# Altium schematic sheet FMC_connector.SchDoc
size A2; DocumentNumber: 3; SheetNumber: 3; SheetTotal: 30
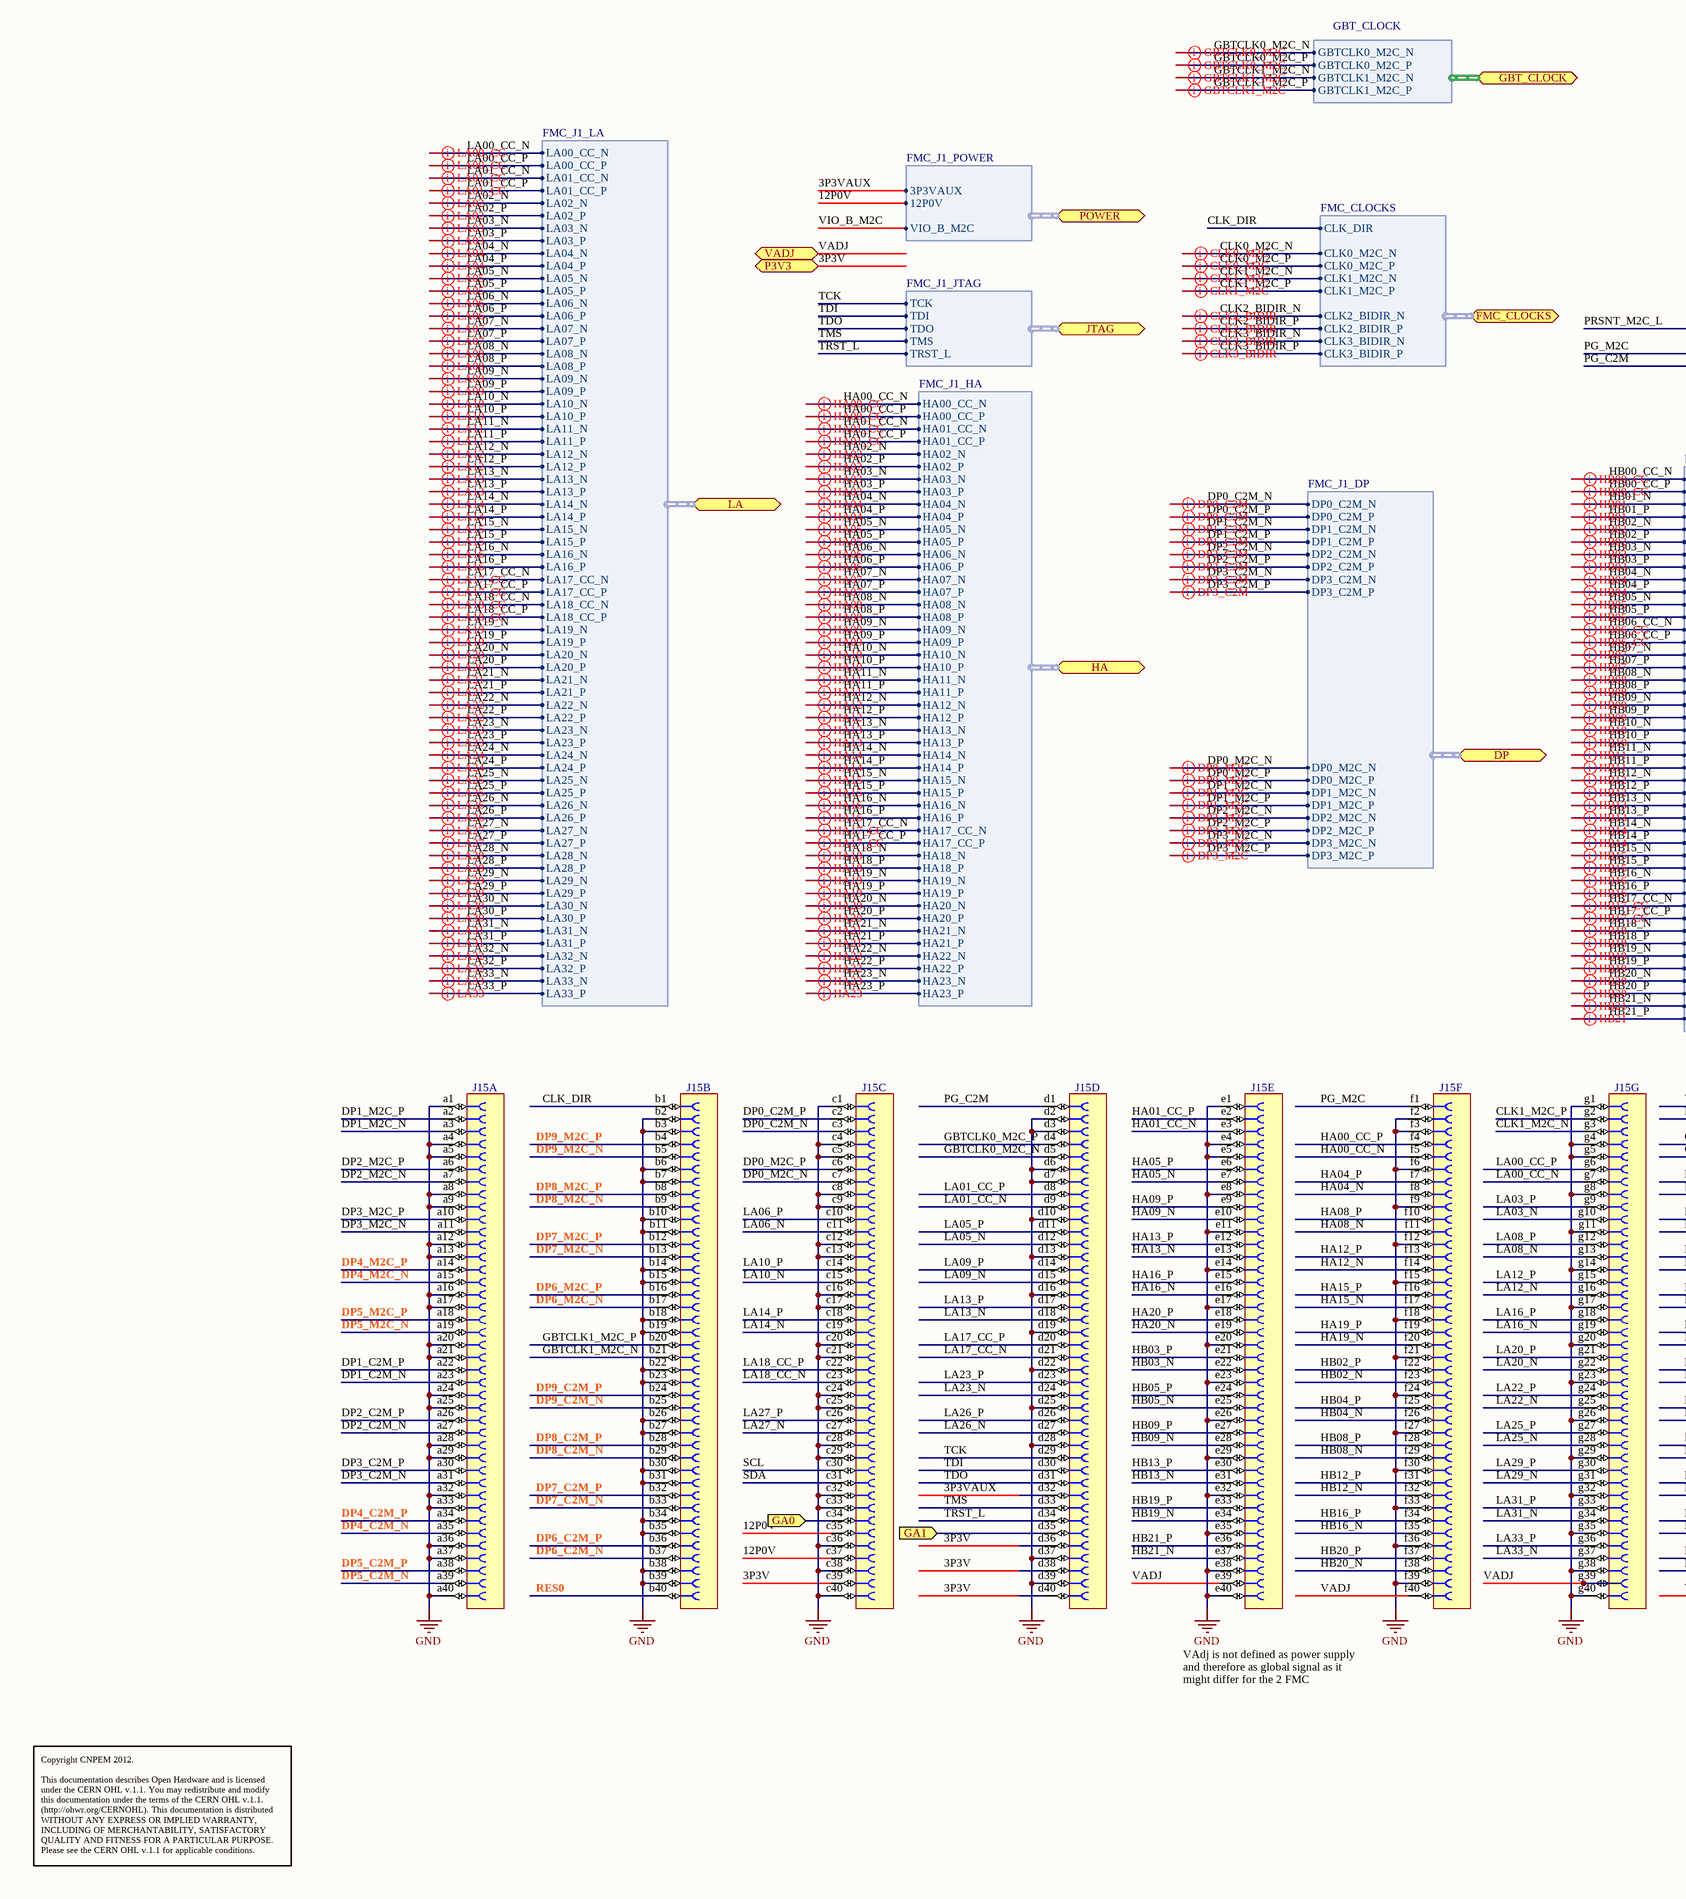
[diagram p0: FMC_connector.SchDoc, left]
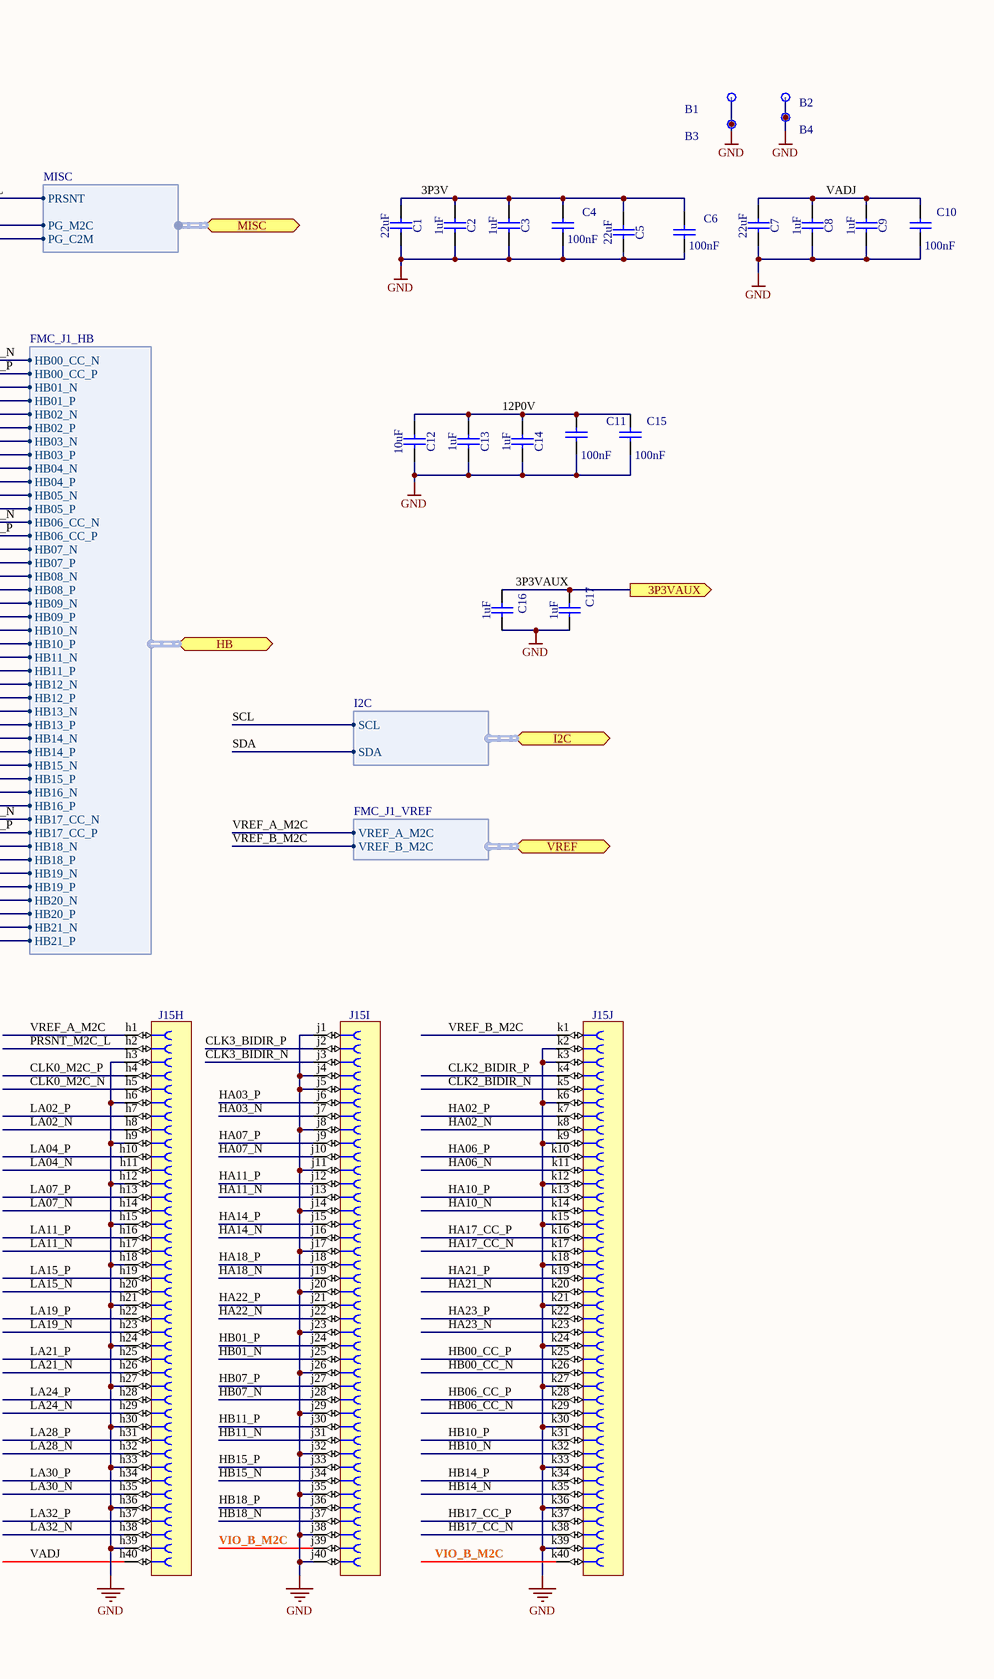
[diagram p1: FMC_connector.SchDoc, right]

## Parts
B1  Plated Hole  [MTG270_500]  (value not drawn)
B2  Plated Hole  [MTG270_500]  (value not drawn)
B3  Plated Hole  [MTG270_500]  (value not drawn)
B4  Plated Hole  [MTG270_500]  (value not drawn)
C1  22uF  [CAPC3216X180N]
C2  1uF  [CAPC1608X87N]
C3  1uF  [CAPC1608X87N]
C4  100nF  [CAPC0603X33N]
C5  22uF  [CAPC3216X180N]
C6  100nF  [CAPC0603X33N]
C7  22uF  [CAPC3216X180N]
C8  1uF  [CAPC1608X87N]
C9  1uF  [CAPC1608X87N]
C10  100nF  [CAPC0603X33N]
C11  100nF  [CAPC0603X33N]
C12  10uF  [CAPC2012X135N]
C13  1uF  [CAPC1608X87N]
C14  1uF  [CAPC1608X87N]
C15  100nF  [CAPC0603X33N]
C16  1uF  [CAPC1608X87N]
C17  1uF  [CAPC1608X87N]
J15  VITA 57  [SAMTEC_ASP-134486-01]  (value not drawn)  (parts A,B,C,D,E,F,G,H,I,J of 10)

## Ports
3P3VAUX (out), DP (harness FMC_J1_DP), FMC_CLOCKS (harness FMC_CLOCKS), GA0 (in), GA1 (in), GBT_CLOCK (harness GBT_CLOCK), HA (harness FMC_J1_HA), HB (harness FMC_J1_HB), I2C (harness I2C), JTAG (harness FMC_J1_JTAG), LA (harness FMC_J1_LA), MISC (harness MISC), P3V3, POWER (harness FMC_J1_POWER), VADJ, VREF (harness FMC_J1_VREF)

## Harnesses
FMC_J1_DP: DP1_C2M_N, DP1_C2M_P, DP1_M2C_N, DP1_M2C_P, DP2_C2M_N, DP2_C2M_P, DP2_M2C_N, DP2_M2C_P, DP3_C2M_N, DP3_C2M_P, DP3_M2C_N, DP3_M2C_P, DP0_C2M_N, DP0_C2M_P, DP0_M2C_N, DP0_M2C_P
FMC_J1_LA: LA05_N, LA05_P, LA06_N, LA06_P, LA09_N, LA09_P, LA10_N, LA10_P, LA13_N, LA13_P, LA14_N, LA14_P, LA23_N, LA23_P, LA26_N, LA26_P, LA27_N, LA27_P, LA02_N, LA02_P, LA03_N, LA03_P, LA04_N, LA04_P, LA07_N, LA07_P, LA08_N, LA08_P, LA11_N, LA11_P, LA12_N, LA12_P, LA15_N, LA15_P, LA16_N, LA16_P, LA19_N, LA19_P, LA20_N, LA20_P, LA21_N, LA21_P, LA22_N, LA22_P, LA24_N, LA24_P, LA25_N, LA25_P, LA28_N, LA28_P, LA29_N, LA29_P, LA30_N, LA30_P, LA31_N, LA31_P, LA32_N, LA32_P, LA33_N, LA33_P, LA00_CC_N, LA00_CC_P, LA01_CC_N, LA01_CC_P, LA17_CC_N, LA17_CC_P, LA18_CC_N, LA18_CC_P
FMC_J1_HA: HA04_N, HA04_P, HA05_N, HA05_P, HA08_N, HA08_P, HA09_N, HA09_P, HA12_N, HA12_P, HA13_N, HA13_P, HA15_N, HA15_P, HA16_N, HA16_P, HA19_N, HA19_P, HA20_N, HA20_P, HA02_N, HA02_P, HA03_N, HA03_P, HA06_N, HA06_P, HA07_N, HA07_P, HA10_N, HA10_P, HA11_N, HA11_P, HA14_N, HA14_P, HA18_N, HA18_P, HA21_N, HA21_P, HA22_N, HA22_P, HA23_N, HA23_P, HA17_CC_N, HA17_CC_P, HA00_CC_N, HA00_CC_P, HA01_CC_N, HA01_CC_P
FMC_J1_HB: HB02_N, HB02_P, HB03_N, HB03_P, HB04_N, HB04_P, HB05_N, HB05_P, HB08_N, HB08_P, HB09_N, HB09_P, HB12_N, HB12_P, HB13_N, HB13_P, HB16_N, HB16_P, HB19_N, HB19_P, HB20_N, HB20_P, HB21_N, HB21_P, HB01_N, HB01_P, HB07_N, HB07_P, HB10_N, HB10_P, HB11_N, HB11_P, HB14_N, HB14_P, HB15_N, HB15_P, HB18_N, HB18_P, HB17_CC_N, HB17_CC_P, HB06_CC_N, HB06_CC_P, HB00_CC_N, HB00_CC_P
FMC_J1_POWER: 3P3VAUX, 12P0V, VIO_B_M2C
FMC_J1_JTAG: TCK, TDI, TDO, TMS, TRST_L
I2C: SCL, SDA
FMC_CLOCKS: CLK2_BIDIR_N, CLK2_BIDIR_P, CLK3_BIDIR_N, CLK3_BIDIR_P, CLK0_M2C_N, CLK0_M2C_P, CLK1_M2C_N, CLK1_M2C_P, CLK_DIR
FMC_J1_VREF: VREF_A_M2C, VREF_B_M2C
GBT_CLOCK: GBTCLK0_M2C_N, GBTCLK0_M2C_P, GBTCLK1_M2C_N, GBTCLK1_M2C_P
MISC: PRSNT, PG_M2C, PG_C2M

## Nets
GND: B1.1 B2.1 B3.1 B4.1 C1.2 C2.2 C3.2 C4.1 C5.2 C6.1 C7.2 C8.2 C9.2 C10.1 C11.1 C12.2 C13.2 C14.2 C15.1 C16.2 C17.2 J15.a1 J15.a4 J15.a5 J15.a8 J15.a9 J15.a12 J15.a13 J15.a16 J15.a17 J15.a20 J15.a21 J15.a24 J15.a25 J15.a28 J15.a29 J15.a32 J15.a33 J15.a36 J15.a37 J15.a40 J15.b2 J15.b3 J15.b6 J15.b7 J15.b10 J15.b11 J15.b14 J15.b15 J15.b18 J15.b19 J15.b22 J15.b23 J15.b26 J15.b27 J15.b30 J15.b31 J15.b34 J15.b35 J15.b38 J15.b39 J15.c1 J15.c4 J15.c5 J15.c8 J15.c9 J15.c12 J15.c13 J15.c16 J15.c17 J15.c20 J15.c21 J15.c24 J15.c25 J15.c28 J15.c29 J15.c32 J15.c33 J15.c36 J15.c38 J15.c40 J15.d2 J15.d3 J15.d6 J15.d7 J15.d10 J15.d13 J15.d16 J15.d19 J15.d22 J15.d25 J15.d28 J15.d37 J15.d39 J15.e1 J15.e4 J15.e5 J15.e8 J15.e11 J15.e14 J15.e17 J15.e20 J15.e23 J15.e26 J15.e29 J15.e32 J15.e35 J15.e38 J15.e40 J15.f2 J15.f3 J15.f6 J15.f9 J15.f12 J15.f15 J15.f18 J15.f21 J15.f24 J15.f27 J15.f30 J15.f33 J15.f36 J15.f39 J15.g1 J15.g4 J15.g5 J15.g8 J15.g11 J15.g14 J15.g17 J15.g20 J15.g23 J15.g26 J15.g29 J15.g32 J15.g35 J15.g38 J15.g40 J15.h3 J15.h6 J15.h9 J15.h12 J15.h15 J15.h18 J15.h21 J15.h24 J15.h27 J15.h30 J15.h33 J15.h36 J15.h39 J15.j1 J15.j4 J15.j5 J15.j8 J15.j11 J15.j14 J15.j17 J15.j20 J15.j23 J15.j26 J15.j29 J15.j32 J15.j35 J15.j38 J15.j40 J15.k2 J15.k3 J15.k6 J15.k9 J15.k12 J15.k15 J15.k18 J15.k21 J15.k24 J15.k27 J15.k30 J15.k33 J15.k36 J15.k39
3P3V: C1.1 C2.1 C3.1 C4.2 C5.1 C6.2 J15.c39 J15.d36 J15.d38 J15.d40 ; port P3V3
3P3VAUX: C16.1 C17.1 J15.d32 ; port 3P3VAUX, port POWER.3P3VAUX
12P0V: C11.2 C12.1 C13.1 C14.1 C15.2 J15.c35 J15.c37 ; port POWER.12P0V
CLK0_M2C_N: J15.h5 ; port FMC_CLOCKS.CLK0_M2C_N
CLK0_M2C_P: J15.h4 ; port FMC_CLOCKS.CLK0_M2C_P
CLK1_M2C_N: J15.g3 ; port FMC_CLOCKS.CLK1_M2C_N
CLK1_M2C_P: J15.g2 ; port FMC_CLOCKS.CLK1_M2C_P
CLK2_BIDIR_N: J15.k5 ; port FMC_CLOCKS.CLK2_BIDIR_N
CLK2_BIDIR_P: J15.k4 ; port FMC_CLOCKS.CLK2_BIDIR_P
CLK3_BIDIR_N: J15.j3 ; port FMC_CLOCKS.CLK3_BIDIR_N
CLK3_BIDIR_P: J15.j2 ; port FMC_CLOCKS.CLK3_BIDIR_P
CLK_DIR: J15.b1 ; port FMC_CLOCKS.CLK_DIR
DP0_C2M_N: J15.c3 ; port DP.DP0_C2M_N
DP0_C2M_P: J15.c2 ; port DP.DP0_C2M_P
DP0_M2C_N: J15.c7 ; port DP.DP0_M2C_N
DP0_M2C_P: J15.c6 ; port DP.DP0_M2C_P
DP1_C2M_N: J15.a23 ; port DP.DP1_C2M_N
DP1_C2M_P: J15.a22 ; port DP.DP1_C2M_P
DP1_M2C_N: J15.a3 ; port DP.DP1_M2C_N
DP1_M2C_P: J15.a2 ; port DP.DP1_M2C_P
DP2_C2M_N: J15.a27 ; port DP.DP2_C2M_N
DP2_C2M_P: J15.a26 ; port DP.DP2_C2M_P
DP2_M2C_N: J15.a7 ; port DP.DP2_M2C_N
DP2_M2C_P: J15.a6 ; port DP.DP2_M2C_P
DP3_C2M_N: J15.a31 ; port DP.DP3_C2M_N
DP3_C2M_P: J15.a30 ; port DP.DP3_C2M_P
DP3_M2C_N: J15.a11 ; port DP.DP3_M2C_N
DP3_M2C_P: J15.a10 ; port DP.DP3_M2C_P
GA0: J15.c34 ; port GA0
GA1: J15.d35 ; port GA1
GBTCLK0_M2C_N: J15.d5 ; port GBT_CLOCK.GBTCLK0_M2C_N
GBTCLK0_M2C_P: J15.d4 ; port GBT_CLOCK.GBTCLK0_M2C_P
GBTCLK1_M2C_N: J15.b21 ; port GBT_CLOCK.GBTCLK1_M2C_N
GBTCLK1_M2C_P: J15.b20 ; port GBT_CLOCK.GBTCLK1_M2C_P
HA00_CC_N: J15.f5 ; port HA.HA00_CC_N
HA00_CC_P: J15.f4 ; port HA.HA00_CC_P
HA01_CC_N: J15.e3 ; port HA.HA01_CC_N
HA01_CC_P: J15.e2 ; port HA.HA01_CC_P
HA02_N: J15.k8 ; port HA.HA02_N
HA02_P: J15.k7 ; port HA.HA02_P
HA03_N: J15.j7 ; port HA.HA03_N
HA03_P: J15.j6 ; port HA.HA03_P
HA04_N: J15.f8 ; port HA.HA04_N
HA04_P: J15.f7 ; port HA.HA04_P
HA05_N: J15.e7 ; port HA.HA05_N
HA05_P: J15.e6 ; port HA.HA05_P
HA06_N: J15.k11 ; port HA.HA06_N
HA06_P: J15.k10 ; port HA.HA06_P
HA07_N: J15.j10 ; port HA.HA07_N
HA07_P: J15.j9 ; port HA.HA07_P
HA08_N: J15.f11 ; port HA.HA08_N
HA08_P: J15.f10 ; port HA.HA08_P
HA09_N: J15.e10 ; port HA.HA09_N
HA09_P: J15.e9 ; port HA.HA09_P
HA10_N: J15.k14 ; port HA.HA10_N
HA10_P: J15.k13 ; port HA.HA10_P
HA11_N: J15.j13 ; port HA.HA11_N
HA11_P: J15.j12 ; port HA.HA11_P
HA12_N: J15.f14 ; port HA.HA12_N
HA12_P: J15.f13 ; port HA.HA12_P
HA13_N: J15.e13 ; port HA.HA13_N
HA13_P: J15.e12 ; port HA.HA13_P
HA14_N: J15.j16 ; port HA.HA14_N
HA14_P: J15.j15 ; port HA.HA14_P
HA15_N: J15.f17 ; port HA.HA15_N
HA15_P: J15.f16 ; port HA.HA15_P
HA16_N: J15.e16 ; port HA.HA16_N
HA16_P: J15.e15 ; port HA.HA16_P
HA17_CC_N: J15.k17 ; port HA.HA17_CC_N
HA17_CC_P: J15.k16 ; port HA.HA17_CC_P
HA18_N: J15.j19 ; port HA.HA18_N
HA18_P: J15.j18 ; port HA.HA18_P
HA19_N: J15.f20 ; port HA.HA19_N
HA19_P: J15.f19 ; port HA.HA19_P
HA20_N: J15.e19 ; port HA.HA20_N
HA20_P: J15.e18 ; port HA.HA20_P
HA21_N: J15.k20 ; port HA.HA21_N
HA21_P: J15.k19 ; port HA.HA21_P
HA22_N: J15.j22 ; port HA.HA22_N
HA22_P: J15.j21 ; port HA.HA22_P
HA23_N: J15.k23 ; port HA.HA23_N
HA23_P: J15.k22 ; port HA.HA23_P
HB00_CC_N: J15.k26 ; port HB.HB00_CC_N
HB00_CC_P: J15.k25 ; port HB.HB00_CC_P
HB01_N: J15.j25 ; port HB.HB01_N
HB01_P: J15.j24 ; port HB.HB01_P
HB02_N: J15.f23 ; port HB.HB02_N
HB02_P: J15.f22 ; port HB.HB02_P
HB03_N: J15.e22 ; port HB.HB03_N
HB03_P: J15.e21 ; port HB.HB03_P
HB04_N: J15.f26 ; port HB.HB04_N
HB04_P: J15.f25 ; port HB.HB04_P
HB05_N: J15.e25 ; port HB.HB05_N
HB05_P: J15.e24 ; port HB.HB05_P
HB06_CC_N: J15.k29 ; port HB.HB06_CC_N
HB06_CC_P: J15.k28 ; port HB.HB06_CC_P
HB07_N: J15.j28 ; port HB.HB07_N
HB07_P: J15.j27 ; port HB.HB07_P
HB08_N: J15.f29 ; port HB.HB08_N
HB08_P: J15.f28 ; port HB.HB08_P
HB09_N: J15.e28 ; port HB.HB09_N
HB09_P: J15.e27 ; port HB.HB09_P
HB10_N: J15.k32 ; port HB.HB10_N
HB10_P: J15.k31 ; port HB.HB10_P
HB11_N: J15.j31 ; port HB.HB11_N
HB11_P: J15.j30 ; port HB.HB11_P
HB12_N: J15.f32 ; port HB.HB12_N
HB12_P: J15.f31 ; port HB.HB12_P
HB13_N: J15.e31 ; port HB.HB13_N
HB13_P: J15.e30 ; port HB.HB13_P
HB14_N: J15.k35 ; port HB.HB14_N
HB14_P: J15.k34 ; port HB.HB14_P
HB15_N: J15.j34 ; port HB.HB15_N
HB15_P: J15.j33 ; port HB.HB15_P
HB16_N: J15.f35 ; port HB.HB16_N
HB16_P: J15.f34 ; port HB.HB16_P
HB17_CC_N: J15.k38 ; port HB.HB17_CC_N
HB17_CC_P: J15.k37 ; port HB.HB17_CC_P
HB18_N: J15.j37 ; port HB.HB18_N
HB18_P: J15.j36 ; port HB.HB18_P
HB19_N: J15.e34 ; port HB.HB19_N
HB19_P: J15.e33 ; port HB.HB19_P
HB20_N: J15.f38 ; port HB.HB20_N
HB20_P: J15.f37 ; port HB.HB20_P
HB21_N: J15.e37 ; port HB.HB21_N
HB21_P: J15.e36 ; port HB.HB21_P
LA00_CC_N: J15.g7 ; port LA.LA00_CC_N
LA00_CC_P: J15.g6 ; port LA.LA00_CC_P
LA01_CC_N: J15.d9 ; port LA.LA01_CC_N
LA01_CC_P: J15.d8 ; port LA.LA01_CC_P
LA02_N: J15.h8 ; port LA.LA02_N
LA02_P: J15.h7 ; port LA.LA02_P
LA03_N: J15.g10 ; port LA.LA03_N
LA03_P: J15.g9 ; port LA.LA03_P
LA04_N: J15.h11 ; port LA.LA04_N
LA04_P: J15.h10 ; port LA.LA04_P
LA05_N: J15.d12 ; port LA.LA05_N
LA05_P: J15.d11 ; port LA.LA05_P
LA06_N: J15.c11 ; port LA.LA06_N
LA06_P: J15.c10 ; port LA.LA06_P
LA07_N: J15.h14 ; port LA.LA07_N
LA07_P: J15.h13 ; port LA.LA07_P
LA08_N: J15.g13 ; port LA.LA08_N
LA08_P: J15.g12 ; port LA.LA08_P
LA09_N: J15.d15 ; port LA.LA09_N
LA09_P: J15.d14 ; port LA.LA09_P
LA10_N: J15.c15 ; port LA.LA10_N
LA10_P: J15.c14 ; port LA.LA10_P
LA11_N: J15.h17 ; port LA.LA11_N
LA11_P: J15.h16 ; port LA.LA11_P
LA12_N: J15.g16 ; port LA.LA12_N
LA12_P: J15.g15 ; port LA.LA12_P
LA13_N: J15.d18 ; port LA.LA13_N
LA13_P: J15.d17 ; port LA.LA13_P
LA14_N: J15.c19 ; port LA.LA14_N
LA14_P: J15.c18 ; port LA.LA14_P
LA15_N: J15.h20 ; port LA.LA15_N
LA15_P: J15.h19 ; port LA.LA15_P
LA16_N: J15.g19 ; port LA.LA16_N
LA16_P: J15.g18 ; port LA.LA16_P
LA17_CC_N: J15.d21 ; port LA.LA17_CC_N
LA17_CC_P: J15.d20 ; port LA.LA17_CC_P
LA18_CC_N: J15.c23 ; port LA.LA18_CC_N
LA18_CC_P: J15.c22 ; port LA.LA18_CC_P
LA19_N: J15.h23 ; port LA.LA19_N
LA19_P: J15.h22 ; port LA.LA19_P
LA20_N: J15.g22 ; port LA.LA20_N
LA20_P: J15.g21 ; port LA.LA20_P
LA21_N: J15.h26 ; port LA.LA21_N
LA21_P: J15.h25 ; port LA.LA21_P
LA22_N: J15.g25 ; port LA.LA22_N
LA22_P: J15.g24 ; port LA.LA22_P
LA23_N: J15.d24 ; port LA.LA23_N
LA23_P: J15.d23 ; port LA.LA23_P
LA24_N: J15.h29 ; port LA.LA24_N
LA24_P: J15.h28 ; port LA.LA24_P
LA25_N: J15.g28 ; port LA.LA25_N
LA25_P: J15.g27 ; port LA.LA25_P
LA26_N: J15.d27 ; port LA.LA26_N
LA26_P: J15.d26 ; port LA.LA26_P
LA27_N: J15.c27 ; port LA.LA27_N
LA27_P: J15.c26 ; port LA.LA27_P
LA28_N: J15.h32 ; port LA.LA28_N
LA28_P: J15.h31 ; port LA.LA28_P
LA29_N: J15.g31 ; port LA.LA29_N
LA29_P: J15.g30 ; port LA.LA29_P
LA30_N: J15.h35 ; port LA.LA30_N
LA30_P: J15.h34 ; port LA.LA30_P
LA31_N: J15.g34 ; port LA.LA31_N
LA31_P: J15.g33 ; port LA.LA31_P
LA32_N: J15.h38 ; port LA.LA32_N
LA32_P: J15.h37 ; port LA.LA32_P
LA33_N: J15.g37 ; port LA.LA33_N
LA33_P: J15.g36 ; port LA.LA33_P
PG_C2M: J15.d1 ; port MISC.PG_C2M
PG_M2C: J15.f1 ; port MISC.PG_M2C
PRSNT_M2C_L: J15.h2 ; port MISC.PRSNT
SCL: J15.c30 ; port I2C.SCL
SDA: J15.c31 ; port I2C.SDA
TCK: J15.d29 ; port JTAG.TCK
TDI: J15.d30 ; port JTAG.TDI
TDO: J15.d31 ; port JTAG.TDO
TMS: J15.d33 ; port JTAG.TMS
TRST_L: J15.d34 ; port JTAG.TRST_L
VADJ: C7.1 C8.1 C9.1 C10.2 J15.e39 J15.f40 J15.g39 J15.h40 ; port VADJ
VIO_B_M2C: port POWER.VIO_B_M2C
VREF_A_M2C: J15.h1 ; port VREF.VREF_A_M2C
VREF_B_M2C: J15.k1 ; port VREF.VREF_B_M2C

Not connected (* = marked no-connect by the designer): J15 a14 a15 a18 a19 a34 a35 a38 a39 b4 b5 b8 b9 b12 b13 b16 b17 b24 b25 b28 b29 b32 b33 b36 b37 b40 j39 k40

## Layout directives
differential pair: CLK0_M2C_N, CLK0_M2C_P, CLK1_M2C_N, CLK1_M2C_P, CLK2_BIDIR_N, CLK2_BIDIR_P, CLK3_BIDIR_N, CLK3_BIDIR_P, DP0_C2M_N, DP0_C2M_P, DP0_M2C_N, DP0_M2C_P, DP1_C2M_N, DP1_C2M_P, DP1_M2C_N, DP1_M2C_P, DP2_C2M_N, DP2_C2M_P, DP2_M2C_N, DP2_M2C_P, DP3_C2M_N, DP3_C2M_P, DP3_M2C_N, DP3_M2C_P, GBTCLK0_M2C_N, GBTCLK0_M2C_P, GBTCLK1_M2C_N, GBTCLK1_M2C_P, HA00_CC_N, HA00_CC_P, HA01_CC_N, HA01_CC_P, HA02_N, HA02_P, HA03_N, HA03_P, HA04_N, HA04_P, HA05_N, HA05_P, HA06_N, HA06_P, HA07_N, HA07_P, HA08_N, HA08_P, HA09_N, HA09_P, HA10_N, HA10_P, HA11_N, HA11_P, HA12_N, HA12_P, HA13_N, HA13_P, HA14_N, HA14_P, HA15_N, HA15_P, HA16_N, HA16_P, HA17_CC_N, HA17_CC_P, HA18_N, HA18_P, HA19_N, HA19_P, HA20_N, HA20_P, HA21_N, HA21_P, HA22_N, HA22_P, HA23_N, HA23_P, HB00_CC_N, HB00_CC_P, HB01_N, HB01_P, HB02_N, HB02_P, HB03_N, HB03_P, HB04_N, HB04_P, HB05_N, HB05_P, HB06_CC_N, HB06_CC_P, HB07_N, HB07_P, HB08_N, HB08_P, HB09_N, HB09_P, HB10_N, HB10_P, HB11_N, HB11_P, HB12_N, HB12_P, HB13_N, HB13_P, HB14_N, HB14_P, HB15_N, HB15_P, HB16_N, HB16_P, HB17_CC_N, HB17_CC_P, HB18_N, HB18_P, HB19_N, HB19_P, HB20_N, HB20_P, HB21_N, HB21_P, LA00_CC_N, LA00_CC_P, LA01_CC_N, LA01_CC_P, LA02_N, LA02_P, LA03_N, LA03_P, LA04_N, LA04_P, LA05_N, LA05_P, LA06_N, LA06_P, LA07_N, LA07_P, LA08_N, LA08_P, LA09_N, LA09_P, LA10_N, LA10_P, LA11_N, LA11_P, LA12_N, LA12_P, LA13_N, LA13_P, LA14_N, LA14_P, LA15_N, LA15_P, LA16_N, LA16_P, LA17_CC_N, LA17_CC_P, LA18_CC_N, LA18_CC_P, LA19_N, LA19_P, LA20_N, LA20_P, LA21_N, LA21_P, LA22_N, LA22_P, LA23_N, LA23_P, LA24_N, LA24_P, LA25_N, LA25_P, LA26_N, LA26_P, LA27_N, LA27_P, LA28_N, LA28_P, LA29_N, LA29_P, LA30_N, LA30_P, LA31_N, LA31_P, LA32_N, LA32_P, LA33_N, LA33_P

## Notes on the sheet
- DP8_M2C_P
- DP9_M2C_P
- DP9_M2C_N
- DP7_M2C_P
- DP7_M2C_N
- DP8_M2C_N
- DP4_M2C_P
- DP4_M2C_N
- DP5_M2C_P
- DP6_M2C_P
- DP6_M2C_N
- DP5_M2C_N
- DP8_C2M_P
- DP9_C2M_P
- DP9_C2M_N
- DP7_C2M_P
- DP7_C2M_N
- DP8_C2M_N
- DP4_C2M_P
- DP4_C2M_N
- DP5_C2M_P
- DP6_C2M_P
- DP6_C2M_N
- DP5_C2M_N
- RES0
- VIO_B_M2C
- VAdj is not defined as power supply and therefore as global signal as it might differ for the 2 FMC mezzanines.
- Copyright CNPEM 2012.
  This documentation describes Open Hardware and is licensed under the CERN OHL v.1.1. You may redistribute and modify this documentation under the terms of the CERN OHL v.1.1. (http://ohwr.org/CERNOHL). This documentation is distributed WITHOUT ANY EXPRESS OR IMPLIED WARRANTY, INCLUDING OF MERCHANTABILITY, SATISFACTORY QUALITY AND FITNESS FOR A PARTICULAR PURPOSE. Please see the CERN OHL v.1.1 for applicable conditions.

## Library data of the parts
B1-B4 = PLATED_HOLE2.7_PAD5.0: Single Terminal Socket; Part Description: Plated Through Hole: Hole Dia.=2.7mm Pad Dia.=5.0mm; Mounted: No; Table: Pads; Part Number: PLATED_HOLE2.7_PAD5.0; Component Kind: Standard (No BOM); Component Type: Standard (No BOM); Pin Count: 1; Family: Plated Hole; Socket: No; SMD: No; Status: None; ComponentHeight: 0mm; Author: CERN DEM JMW; CreateDate: 2011-09-27; LatestRevisionDate: 2011-09-27; PackageDescription: Plated Through Hole: Hole Dia.=2.7mm Pad Dia.=5.0mm
C1 C5 C7 = CC1206_22UF_10V_10%_X7R: Non-polarised capacitor; Part Description: SMD Multilayer Chip Ceramic Capacitor; Manufacturer: GENERIC; Manufacturer1 Part Number: GRM31CR71A226KE15L; Voltage: 10V; TC: X7R; Tolerance: ±10%; Table: Capacitors SMD; Part Number: CC1206_22UF_10V_10%_X7R; Component Kind: Standard; Component Type: Standard; Pin Count: 2; Value: 22uF; Status: Preferred; Manufacturer Part Number: CC1206_22UF_10V_10%_X7R; Case: 1206; Mounted: Yes; Socket: No; SMD: Yes; Manufacturer1 Example: MURATA; Manufacturer1 ComponentHeight: 1.8mm; HelpURL: \\cern.ch\dfs\Applications\Altium\Datasheets\CC1206_X7R_MURATA_GRM-HI-CAP.pdf; Author: CERN DEM JLC; CreateDate: 2010-06-08; LatestRevisionDate: 2010-06-08
C2 C3 C8 C9 C13 C14 C16 C17 = CC0603_1UF_16V_10%_X7R: Non-polarised capacitor; Part Description: SMD Multilayer Chip Ceramic Capacitor; Manufacturer: GENERIC; Manufacturer1 Part Number: 223824613663; Voltage: 16V; TC: X7R; Tolerance: ±10%; Table: Capacitors SMD; Part Number: CC0603_1UF_16V_10%_X7R; Component Kind: Standard; Component Type: Standard; Pin Count: 2; Value: 1uF; Status: Preferred; Manufacturer Part Number: CC0603_1uF_16V_10%_X7R; Case: 0603; Mounted: Yes; Socket: No; SMD: Yes; Manufacturer1 Example: PHYCOMP; Manufacturer1 ComponentHeight: 0.87mm; HelpURL: \\cern.ch\dfs\Applications\Altium\Datasheets\CC0805_X5R_PHYCOMP_HC.pdf; Author: CERN DEM JLC; CreateDate: 2007-12-03; LatestRevisionDate: 2007-12-03
C4 C6 C10 C11 C15 = CC0201_100NF_6.3V_10%_X5R: Non-polarised capacitor; Part Description: SMD Multilayer Chip Ceramic Capacitor; Manufacturer: GENERIC; Manufacturer1 Part Number: 02016D104KAT2A; Voltage: 6.3V; TC: X5R; Tolerance: ±10%; Table: Capacitors SMD; Part Number: CC0201_100NF_6.3V_10%_X5R; Component Kind: Standard; Component Type: Standard; Pin Count: 2; Value: 100nF; Status: Not Recommended; Manufacturer Part Number: CC0201_100NF_6.3V_10%_X5R; Case: 0201; Mounted: Yes; Socket: No; SMD: Yes; Manufacturer1 Example: AVX; Manufacturer1 ComponentHeight: 0.33mm; HelpURL: \\cern.ch\dfs\Applications\Altium\Datasheets\CC0201_X5R_AVX.pdf; Author: CERN DEM JLC; CreateDate: 2007-12-03; LatestRevisionDate: 2007-12-03
C12 = CC0805_10UF_16V_10%_X5R: Non-polarised capacitor; Part Description: SMD Multilayer Chip Ceramic Capacitor; Manufacturer: GENERIC; Manufacturer1 Part Number: C0805C106K4PAC; Voltage: 16V; TC: X5R; Tolerance: ±10%; Table: Capacitors SMD; Part Number: CC0805_10UF_16V_10%_X5R; Component Kind: Standard; Component Type: Standard; Pin Count: 2; Value: 10uF; Status: Preferred; Manufacturer Part Number: CC0805_10UF_16V_10%_X5R; Case: 0805; Mounted: Yes; Socket: No; SMD: Yes; Manufacturer1 Example: KEMET; Manufacturer1 ComponentHeight: 1.4mm; HelpURL: \\cern.ch\dfs\Applications\Altium\Datasheets\CC1206_X5R_KEMET.pdf; Author: CERN DEM JLC; CreateDate: 2007-12-03; LatestRevisionDate: 2007-12-03
J15 = SAMTEC_ASP-134486-01: Connector VITA 57, 400 Female contacts in 10 row abcdefghj; Part Description: 400 contacts (10 rows abcdefghj) Surface Mount Female Connector, VITA 57; Manufacturer: SAMTEC; Part Number: SAMTEC_ASP-134486-01; Component Kind: Standard; Component Type: Standard; Pin Count: 400; Family: VITA 57; Mounted: Yes; Socket: No; SMD: Yes; Status: None; Manufacturer Part Number: ASP-134486-01; ComponentHeight: 6.55mm; HelpURL: \\cern.ch\dfs\Applications\Altium\Datasheets\SAMTEC_ASP-134486-01.pdf; Author: CERN DEM JLC; CreateDate: 30/04/2009; LatestRevisionDate: 17/08/2009; Table: SAMTEC